# EAGLE design RGB_driver_main (EAGLE 6.4)
PROJECT: RGB_driver

## Sheet 1 of 7
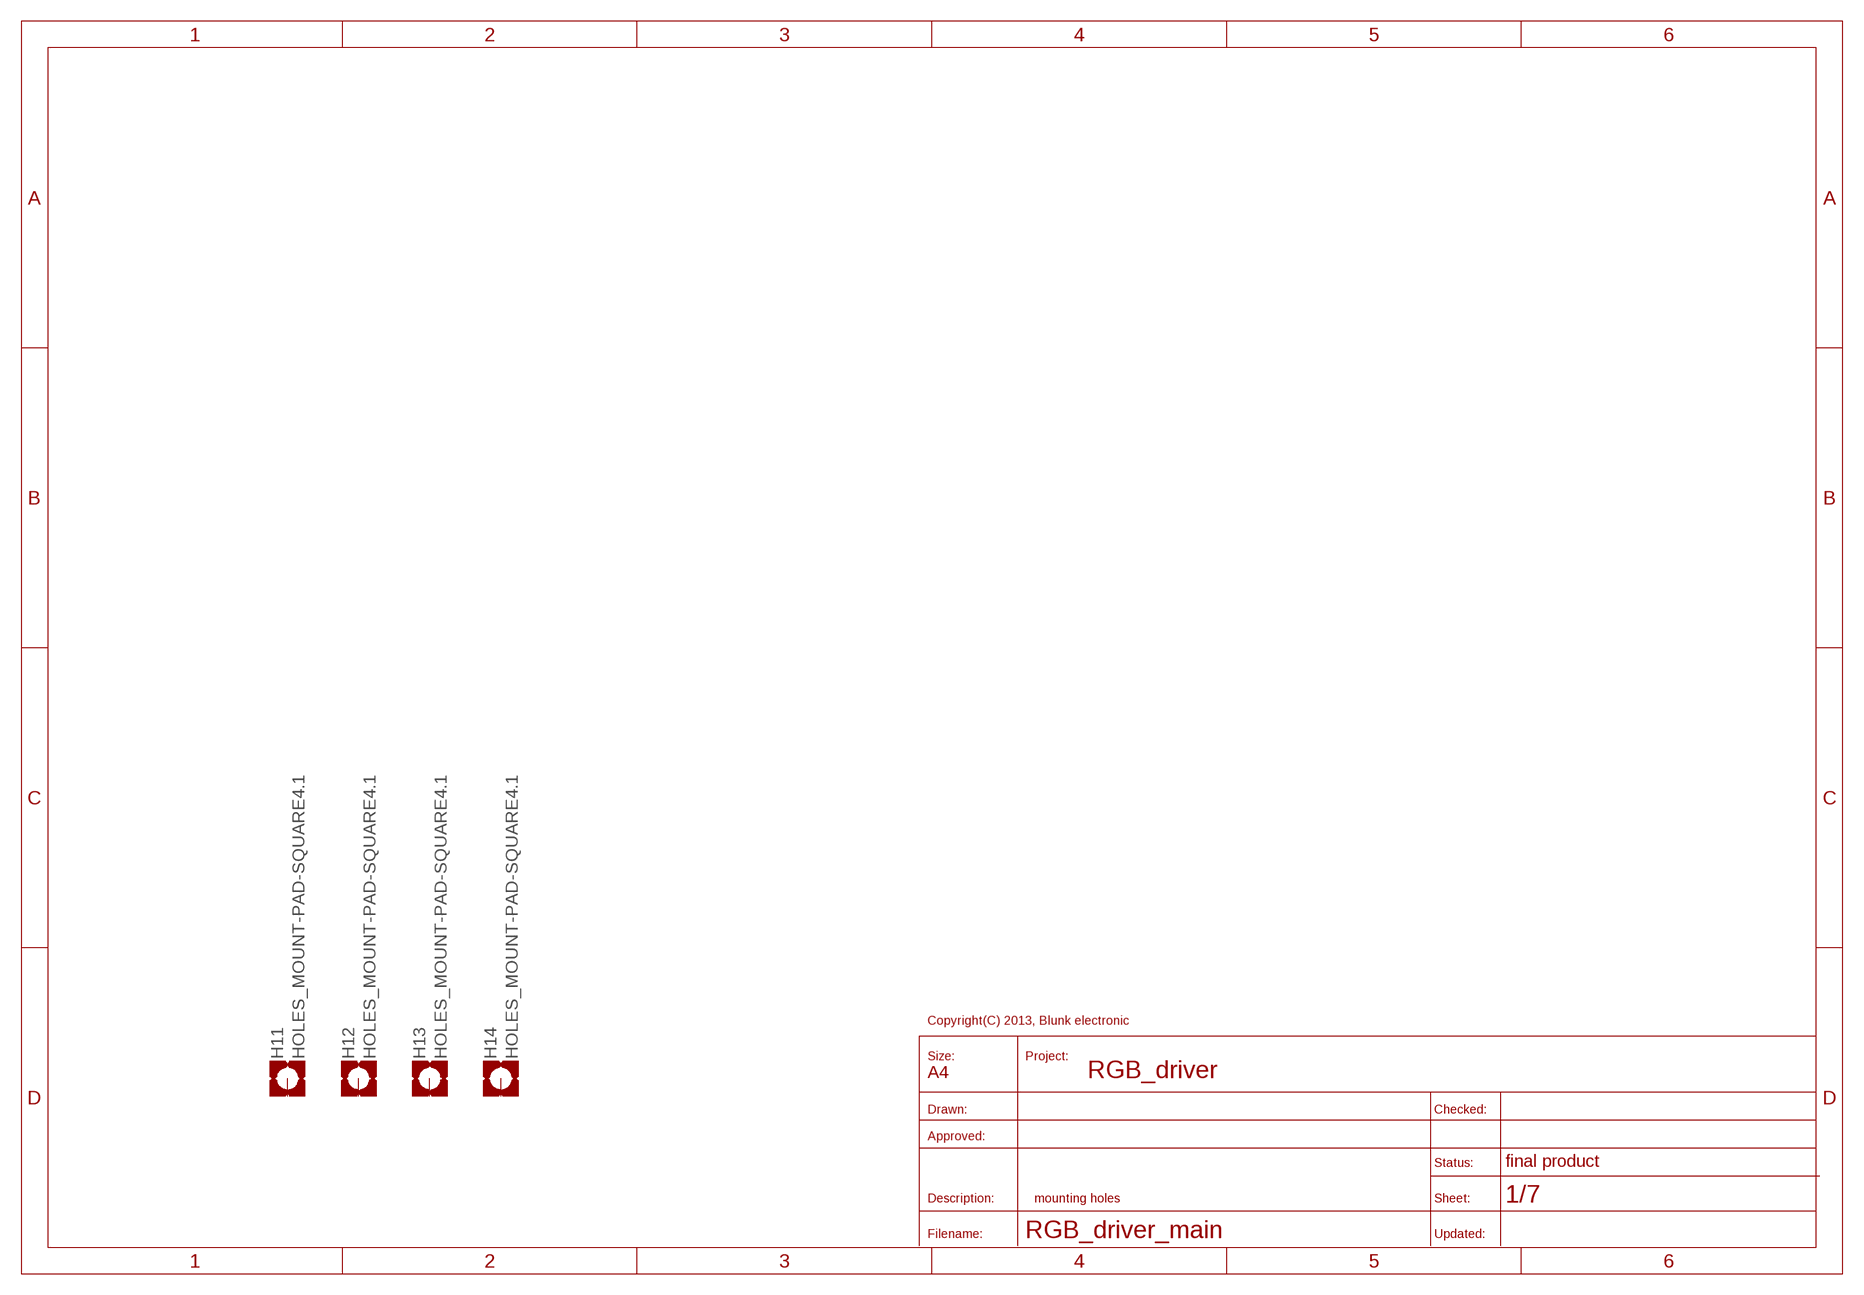
[diagram p0: schematic, sheet 1]
U$1 (A4_LANDSCAPE_FINAL): COMMISSIONED: 2013-03-26

### Parts
H11  HOLES_MOUNT-PAD-SQUARE4.1  [HOLES_4,1-PAD-SQUARE]
H12  HOLES_MOUNT-PAD-SQUARE4.1  [HOLES_4,1-PAD-SQUARE]
H13  HOLES_MOUNT-PAD-SQUARE4.1  [HOLES_4,1-PAD-SQUARE]
H14  HOLES_MOUNT-PAD-SQUARE4.1  [HOLES_4,1-PAD-SQUARE]
Unconnected: H11.B4,1(MOUNT) H12.B4,1(MOUNT) H13.B4,1(MOUNT) H14.B4,1(MOUNT)

### Notes on the sheet
- mounting holes

## Sheet 2 of 7
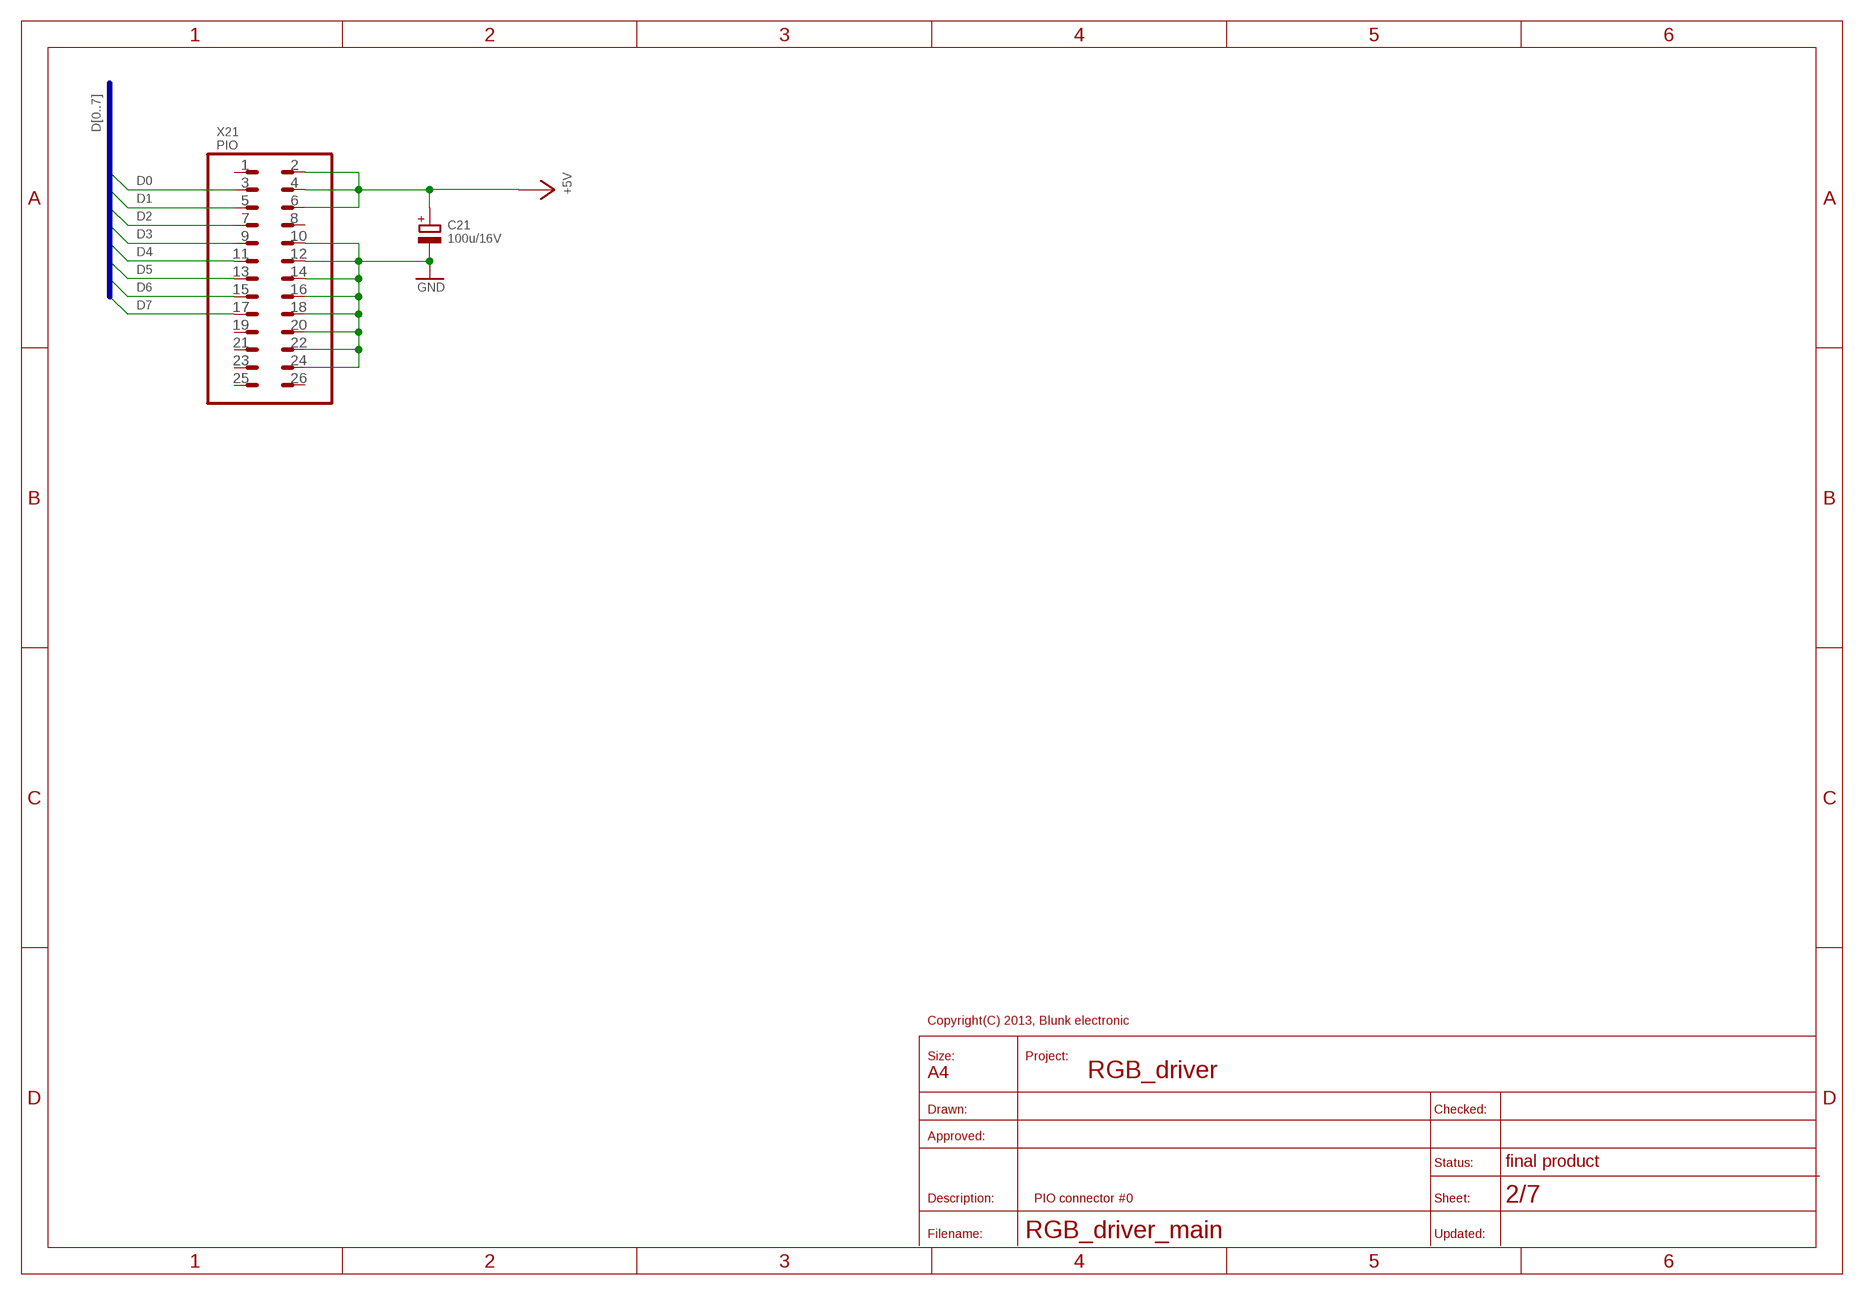
[diagram p1: schematic, sheet 2]
U$2 (A4_LANDSCAPE_FINAL): COMMISSIONED: 2013-03-26

### Parts
C21  100u/16V  C_POL_EU_T_D7/2.54  [T_D7/2.54]
X21  PIO  MALE_2X13-T-0  [T_PINHEAD_2X13-0]

### Nets
+5V [PWR]: C21.+ X21.2 X21.4 X21.6 ; also sheet 3,4,5,6,7
D0: X21.3 ; also sheet 3,4
D1: X21.5 ; also sheet 3,6
D2: X21.7 ; also sheet 3,5
D3: X21.9 ; also sheet 3,7
D4: X21.11 ; also sheet 3,7
D5: X21.13 ; also sheet 3,7
D6: X21.15 ; also sheet 3,7
D7: X21.17 ; also sheet 3
GND [PWR]: C21.- X21.10 X21.12 X21.14 X21.16 X21.18 X21.20 X21.22 X21.24 ; also sheet 3,4,5,6,7
Unconnected: X21.1 X21.8 X21.19 X21.21 X21.23 X21.25 X21.26

### Buses
D[0..7]

### Notes on the sheet
- PIO connector #0

## Sheet 3 of 7
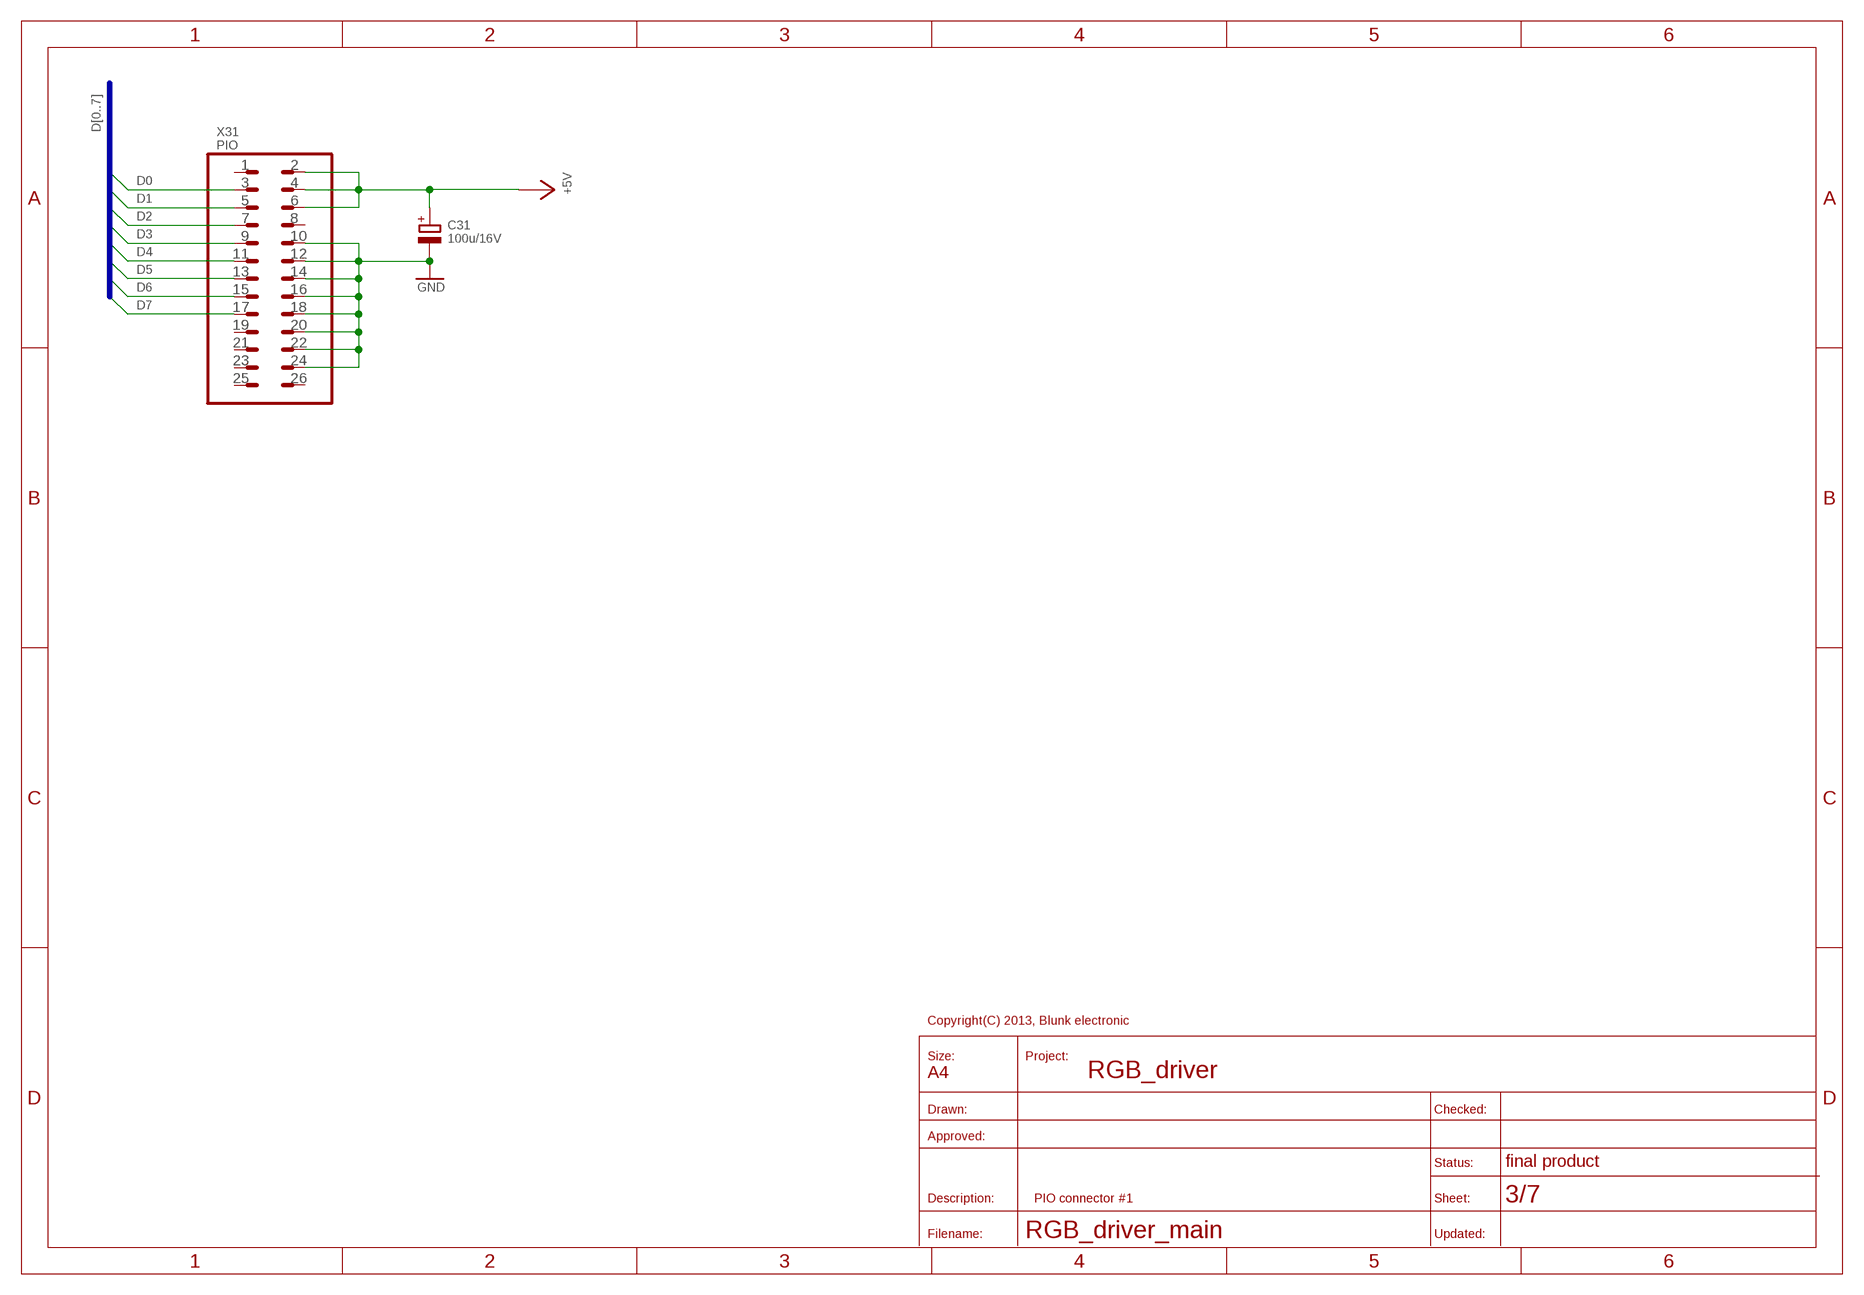
[diagram p2: schematic, sheet 3]
U$3 (A4_LANDSCAPE_FINAL): COMMISSIONED: 2013-03-26

### Parts
C31  100u/16V  C_POL_EU_T_D7/2.54  [T_D7/2.54]
X31  PIO  MALE_2X13-T-0  [T_PINHEAD_2X13-0]

### Nets
+5V [PWR]: C31.+ X31.2 X31.4 X31.6 ; also sheet 2,4,5,6,7
D0: X31.3 ; also sheet 2,4
D1: X31.5 ; also sheet 2,6
D2: X31.7 ; also sheet 2,5
D3: X31.9 ; also sheet 2,7
D4: X31.11 ; also sheet 2,7
D5: X31.13 ; also sheet 2,7
D6: X31.15 ; also sheet 2,7
D7: X31.17 ; also sheet 2
GND [PWR]: C31.- X31.10 X31.12 X31.14 X31.16 X31.18 X31.20 X31.22 X31.24 ; also sheet 2,4,5,6,7
Unconnected: X31.1 X31.8 X31.19 X31.21 X31.23 X31.25 X31.26

### Buses
D[0..7]

### Notes on the sheet
- PIO connector #1

## Sheet 4 of 7
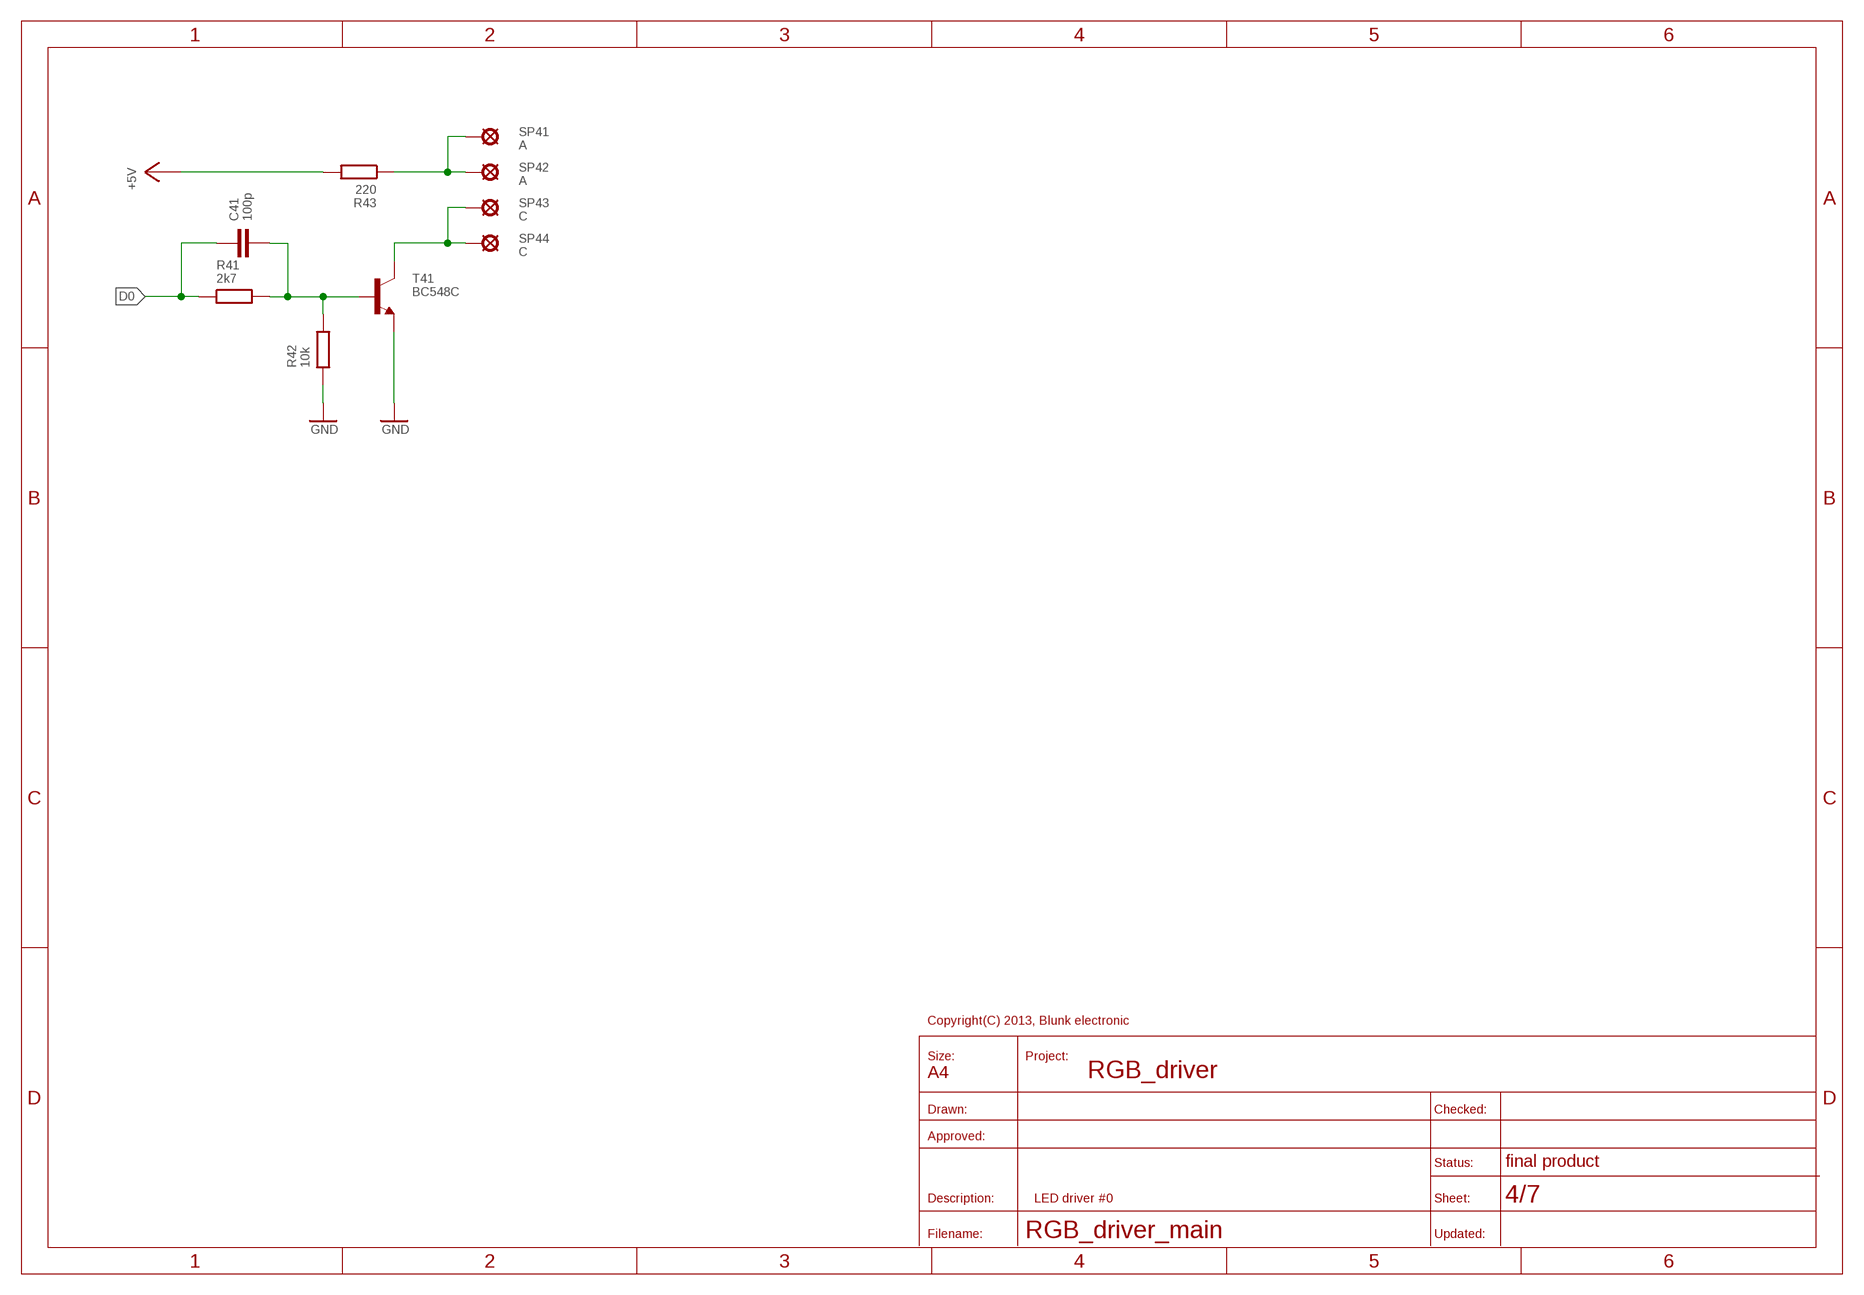
[diagram p3: schematic, sheet 4]
U$4 (A4_LANDSCAPE_FINAL): COMMISSIONED: 2013-03-26

### Parts
C41  100p  C_EU_S_0805  [S_0805]
R41  2k7  R_EU_S_0805  [S_0805]
R42  10k  R_EU_S_0805  [S_0805]
R43  220  R_EU_S_0805  [S_0805]
SP41  A  TEST_POINT-T-SMALL  [T_TEST_POINT_SMALL]
SP42  A  TEST_POINT-T-SMALL  [T_TEST_POINT_SMALL]
SP43  C  TEST_POINT-T-SMALL  [T_TEST_POINT_SMALL]
SP44  C  TEST_POINT-T-SMALL  [T_TEST_POINT_SMALL]
T41  BC548C  NPN  [T_TO-92-CBE]

### Nets
+5V [PWR]: R43.2 ; also sheet 2,3,5,6,7
A0: R43.1 SP41.1(MP) SP42.1(MP)
B0: C41.2 R41.2 R42.2 T41.B
C0: SP43.1(MP) SP44.1(MP) T41.C
D0: C41.1 R41.1 ; also sheet 2,3
GND [PWR]: R42.1 T41.E ; also sheet 2,3,5,6,7

### Notes on the sheet
- LED driver #0

## Sheet 5 of 7
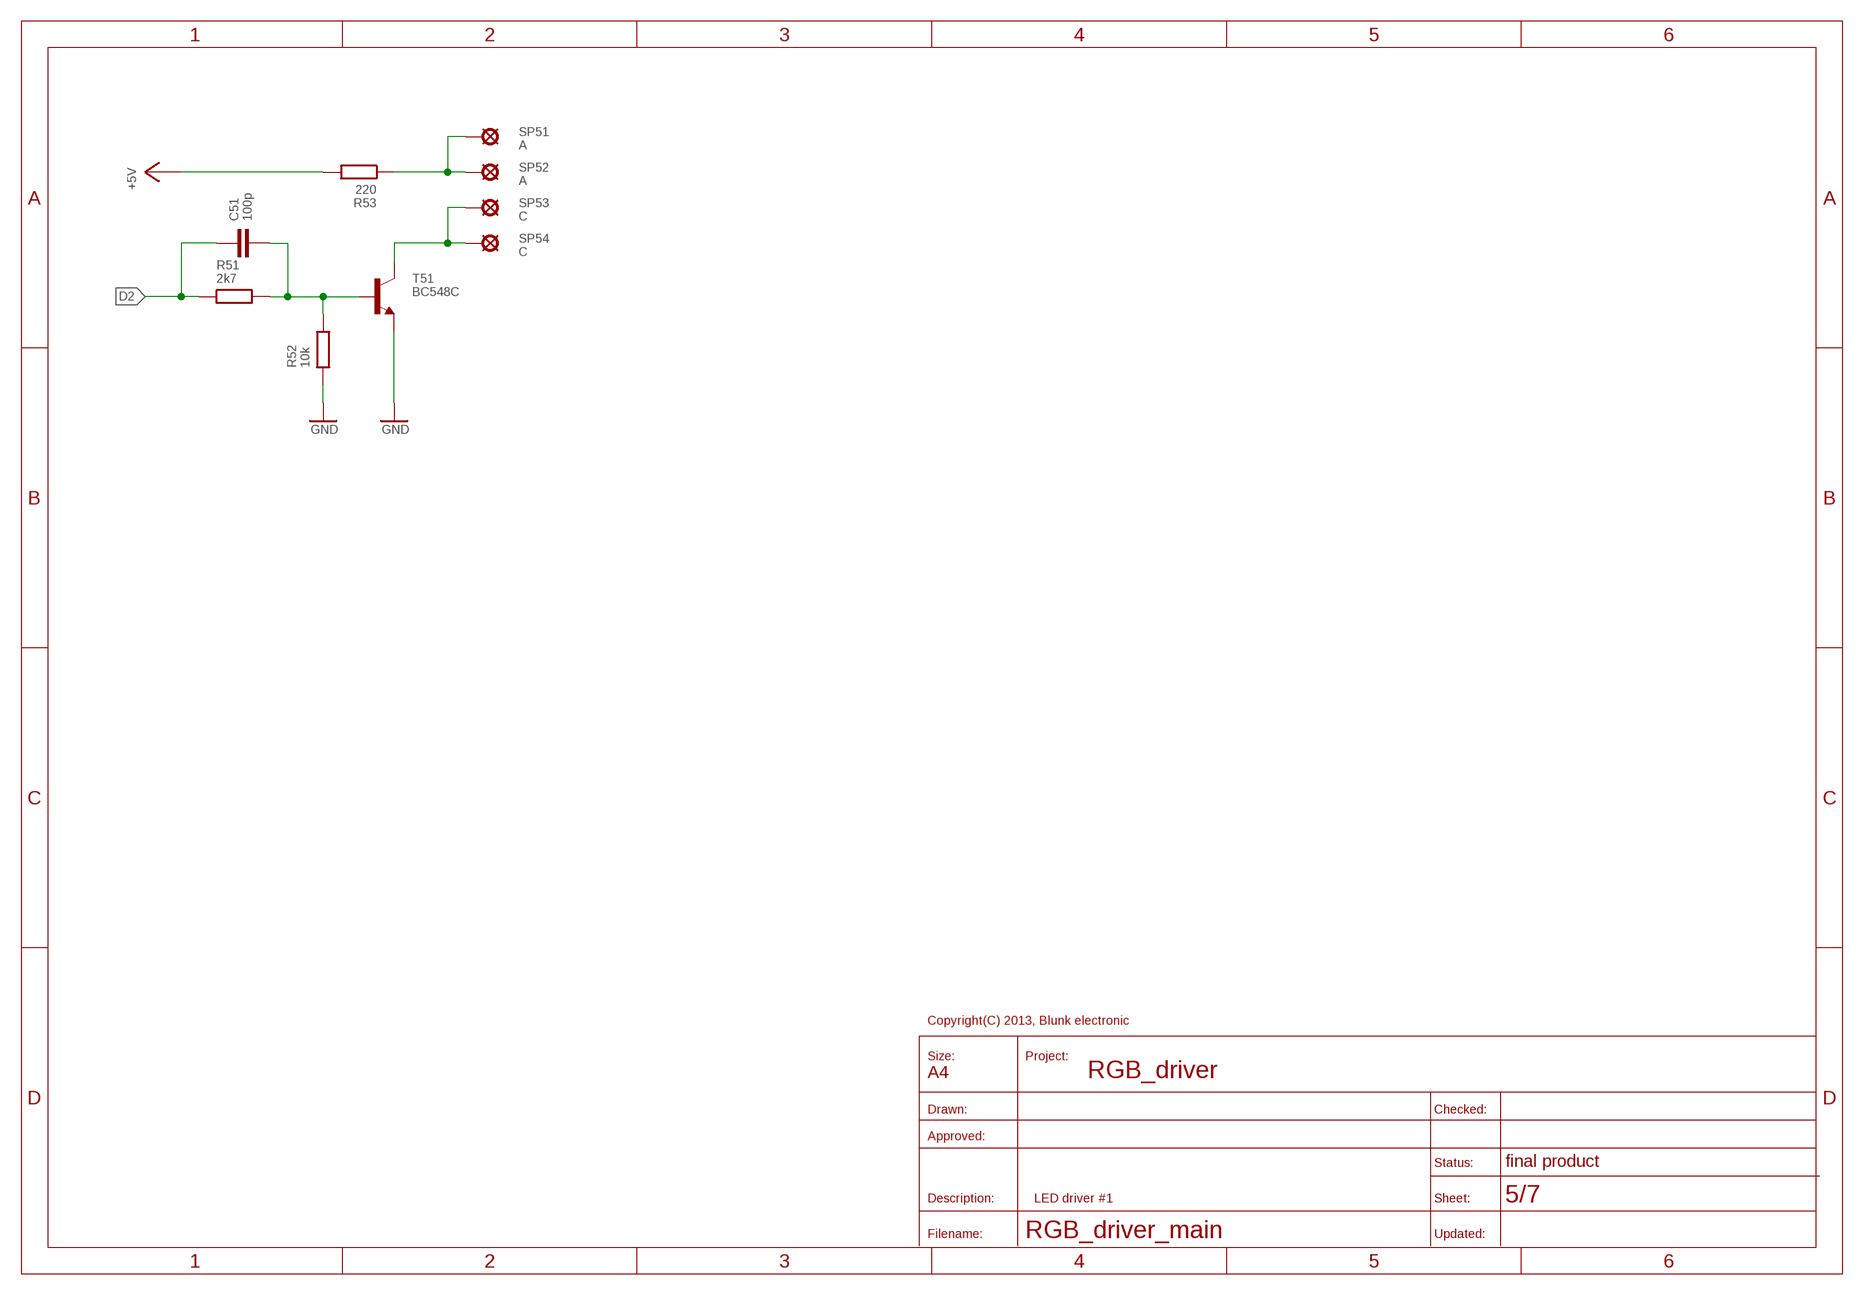
[diagram p4: schematic, sheet 5]
U$5 (A4_LANDSCAPE_FINAL): COMMISSIONED: 2013-03-26

### Parts
C51  100p  C_EU_S_0805  [S_0805]
R51  2k7  R_EU_S_0805  [S_0805]
R52  10k  R_EU_S_0805  [S_0805]
R53  220  R_EU_S_0805  [S_0805]
SP51  A  TEST_POINT-T-SMALL  [T_TEST_POINT_SMALL]
SP52  A  TEST_POINT-T-SMALL  [T_TEST_POINT_SMALL]
SP53  C  TEST_POINT-T-SMALL  [T_TEST_POINT_SMALL]
SP54  C  TEST_POINT-T-SMALL  [T_TEST_POINT_SMALL]
T51  BC548C  NPN  [T_TO-92-CBE]

### Nets
+5V [PWR]: R53.2 ; also sheet 2,3,4,6,7
A1: R53.1 SP51.1(MP) SP52.1(MP)
B1: C51.2 R51.2 R52.2 T51.B
C1: SP53.1(MP) SP54.1(MP) T51.C
D2: C51.1 R51.1 ; also sheet 2,3
GND [PWR]: R52.1 T51.E ; also sheet 2,3,4,6,7

### Notes on the sheet
- LED driver #1

## Sheet 6 of 7
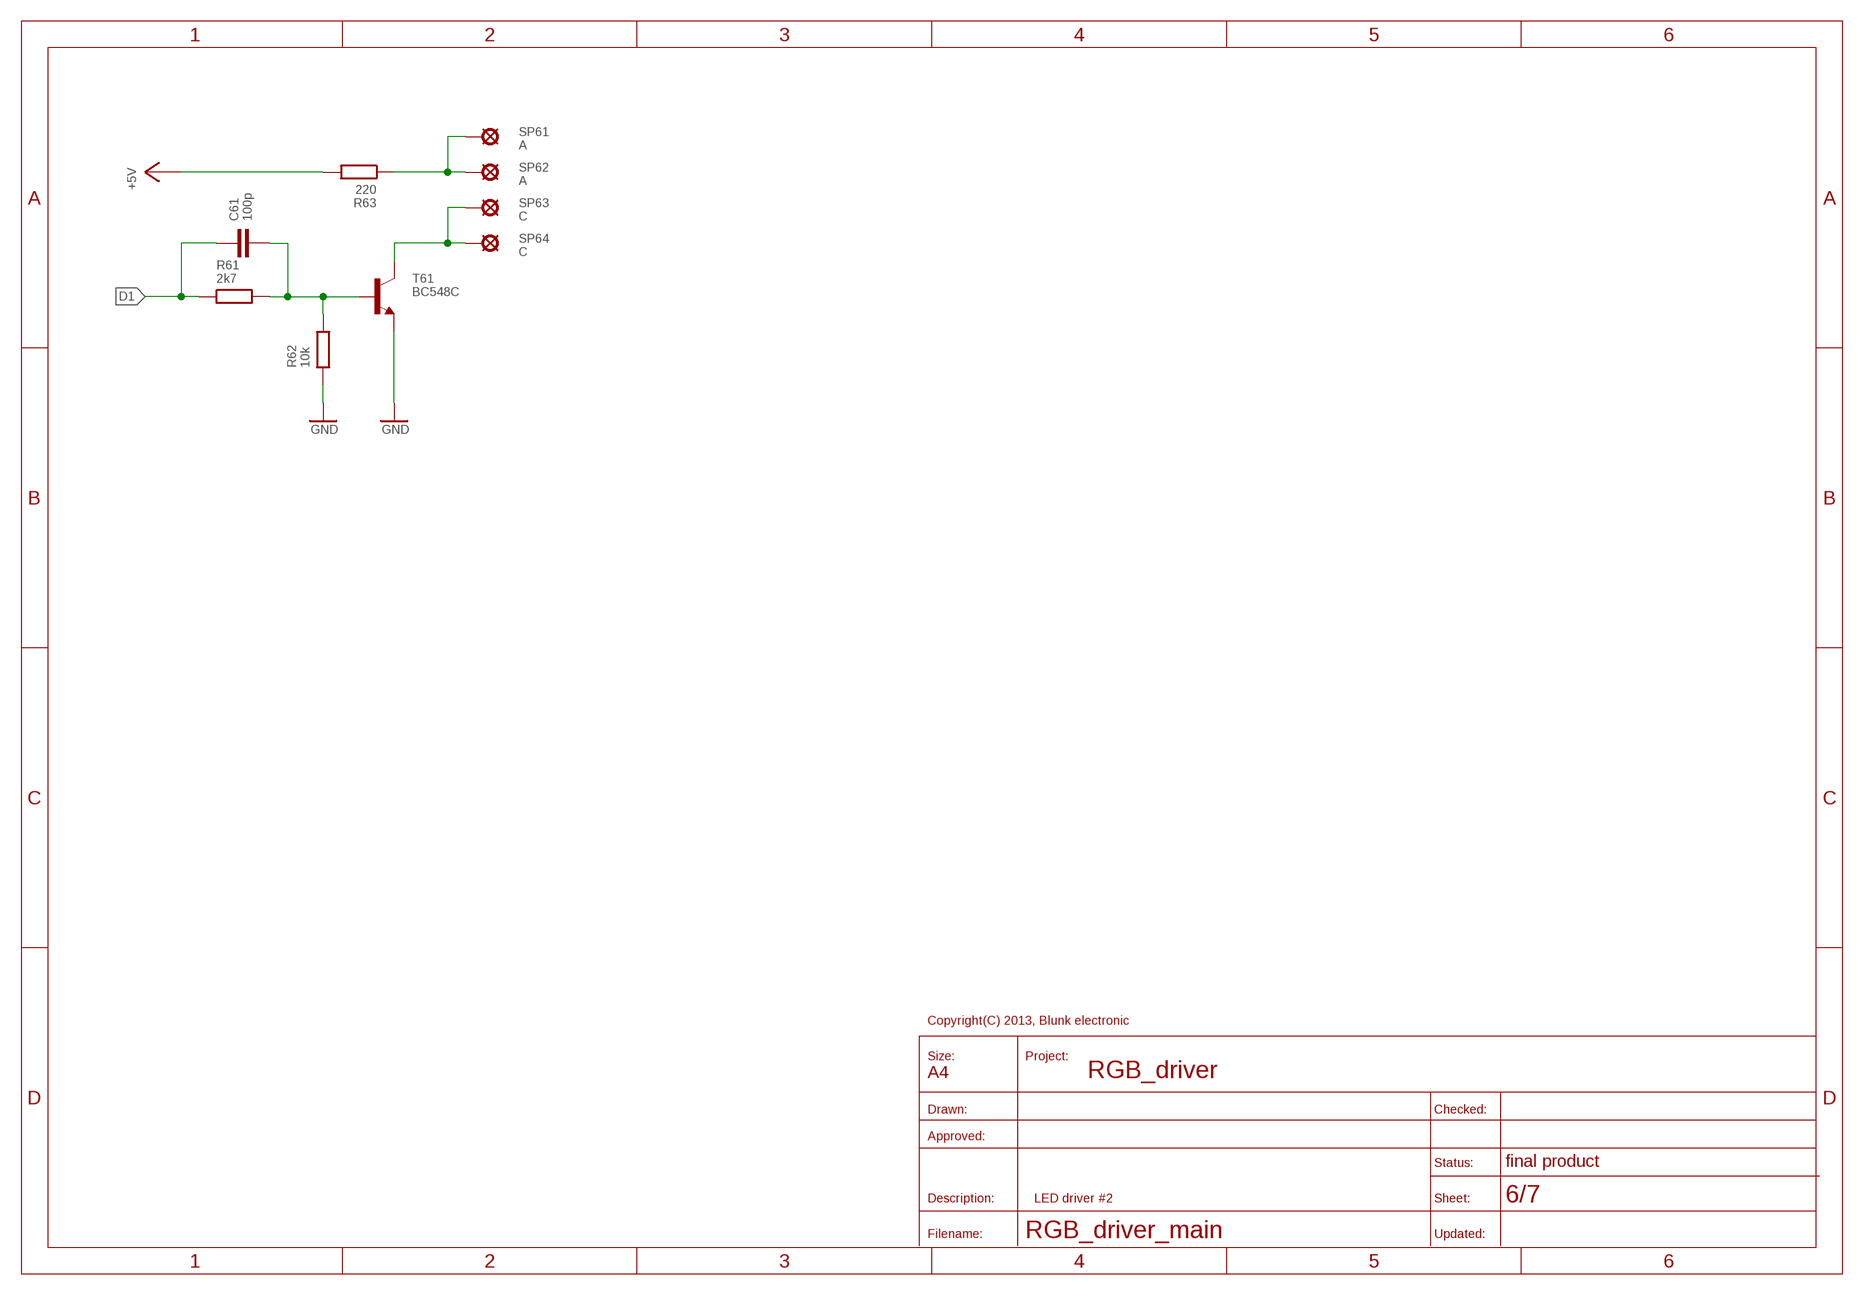
[diagram p5: schematic, sheet 6]
U$6 (A4_LANDSCAPE_FINAL): COMMISSIONED: 2013-03-26

### Parts
C61  100p  C_EU_S_0805  [S_0805]
R61  2k7  R_EU_S_0805  [S_0805]
R62  10k  R_EU_S_0805  [S_0805]
R63  220  R_EU_S_0805  [S_0805]
SP61  A  TEST_POINT-T-SMALL  [T_TEST_POINT_SMALL]
SP62  A  TEST_POINT-T-SMALL  [T_TEST_POINT_SMALL]
SP63  C  TEST_POINT-T-SMALL  [T_TEST_POINT_SMALL]
SP64  C  TEST_POINT-T-SMALL  [T_TEST_POINT_SMALL]
T61  BC548C  NPN  [T_TO-92-CBE]

### Nets
+5V [PWR]: R63.2 ; also sheet 2,3,4,5,7
A2: R63.1 SP61.1(MP) SP62.1(MP)
B2: C61.2 R61.2 R62.2 T61.B
C2: SP63.1(MP) SP64.1(MP) T61.C
D1: C61.1 R61.1 ; also sheet 2,3
GND [PWR]: R62.1 T61.E ; also sheet 2,3,4,5,7

### Notes on the sheet
- LED driver #2

## Sheet 7 of 7
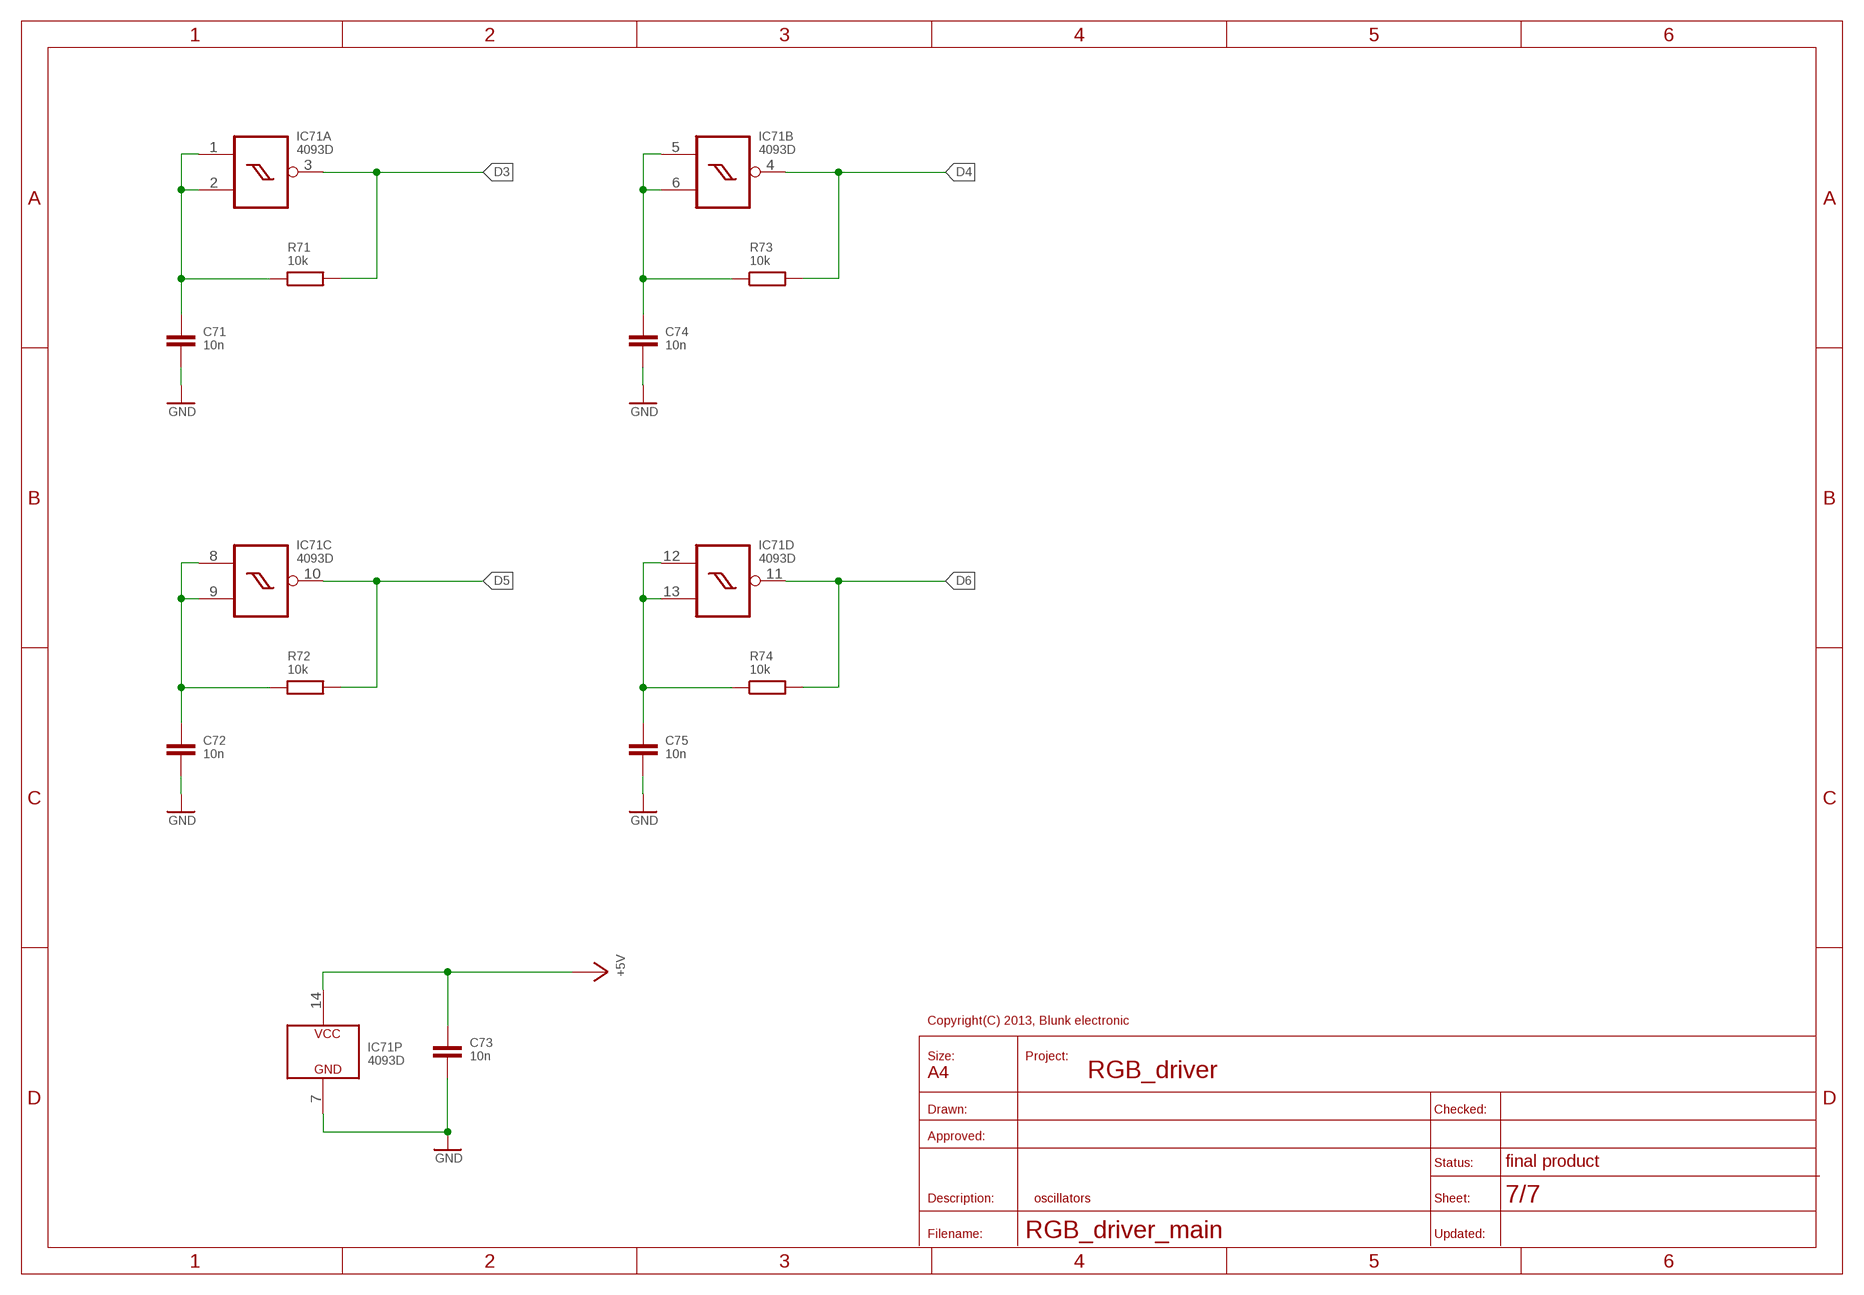
[diagram p6: schematic, sheet 7]
U$7 (A4_LANDSCAPE_FINAL): COMMISSIONED: 2013-03-26

### Parts
C71  10n  C_EU_S_0805  [S_0805]
C72  10n  C_EU_S_0805  [S_0805]
C73  10n  C_EU_S_0805  [S_0805]
C74  10n  C_EU_S_0805  [S_0805]
C75  10n  C_EU_S_0805  [S_0805]
IC71  4093D  [S_SO14]
R71  10k  R_EU_S_0805  [S_0805]
R72  10k  R_EU_S_0805  [S_0805]
R73  10k  R_EU_S_0805  [S_0805]
R74  10k  R_EU_S_0805  [S_0805]

### Nets
+5V [PWR]: C73.1 IC71.14(P:VCC) ; also sheet 2,3,4,5,6
D3: IC71.3(A:O) R71.2 ; also sheet 2,3
D4: IC71.4(B:O) R73.2 ; also sheet 2,3
D5: IC71.10(C:O) R72.2 ; also sheet 2,3
D6: IC71.11(D:O) R74.2 ; also sheet 2,3
GND [PWR]: C71.2 C72.2 C73.2 C74.2 C75.2 IC71.7(P:GND) ; also sheet 2,3,4,5,6
OSC_RC0: C71.1 IC71.1(A:I0) IC71.2(A:I1) R71.1
OSC_RC1: C74.1 IC71.5(B:I0) IC71.6(B:I1) R73.1
OSC_RC2: C72.1 IC71.8(C:I0) IC71.9(C:I1) R72.1
OSC_RC3: C75.1 IC71.12(D:I0) IC71.13(D:I1) R74.1

### Notes on the sheet
- oscillators

## Library data of the parts
C21 C31 = be_rcl:C_POL_EU: Polarized Capacitor Device EU drawn: Mario Blunk / Blunk electronic; COMMISSIONED: 2013-05-06
C41 C51 C61 C71-C75 = be_rcl:C_EU: Capacitor Device EU drawn: Mario Blunk / Blunk electronic
H11-H14 = be_mount_holes:HOLES_MOUNT-PAD-SQUARE: MOUNTING PAD, square
IC71 = be_logic:4093: Quad 2-input NAND with schmitt trigger inputs drawn: Mario Blunk / Blunk electronic; COMMISSIONED: 2013-05-06
R41-R43 R51-R53 R61-R63 R71-R74 = be_rcl:R_EU: Resistor Device EU drawn: Mario Blunk / Blunk electronic
SP41-SP44 SP51-SP54 SP61-SP64 = be_con_jump:TEST_POINT: test point device drawn: Mario Blunk / Blunk electronic; COMMISSIONED: 2013-03-28
T41 T51 T61 = be_transistoren:NPN: NPN Transistor device drawn: Mario Blunk / Blunk electronic; COMMISSIONED: 2013-05-03
X21 X31 = be_con_jump:MALE_2X13: male connector device 2x13 drawn: Mario Blunk / Blunk electronic; COMMISSIONED: 2013-05-06

## Net classes
1 PWR: width 0.254 mm

## Board
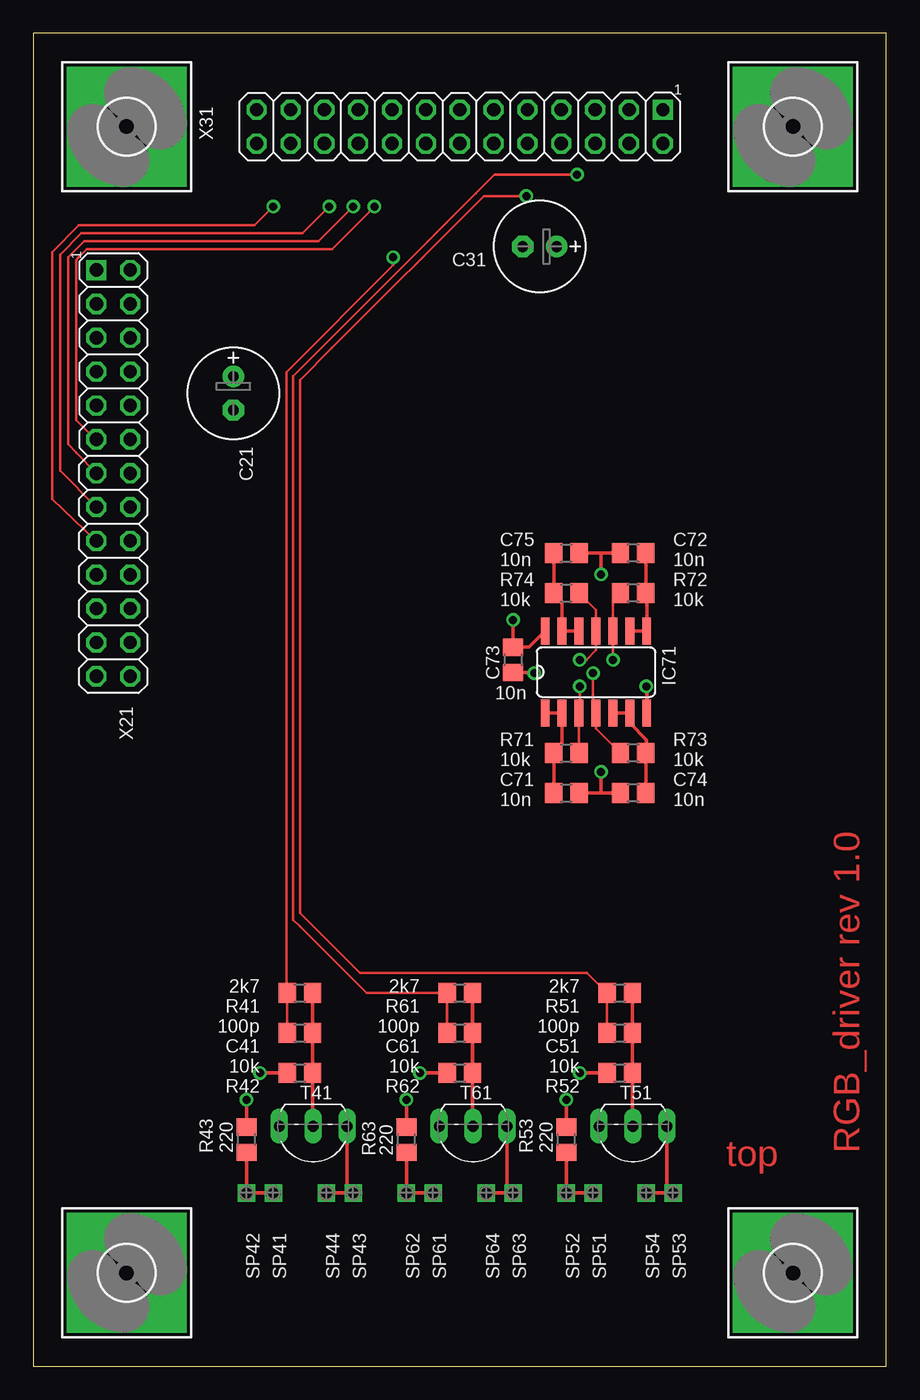
[diagram p7: board, top side]
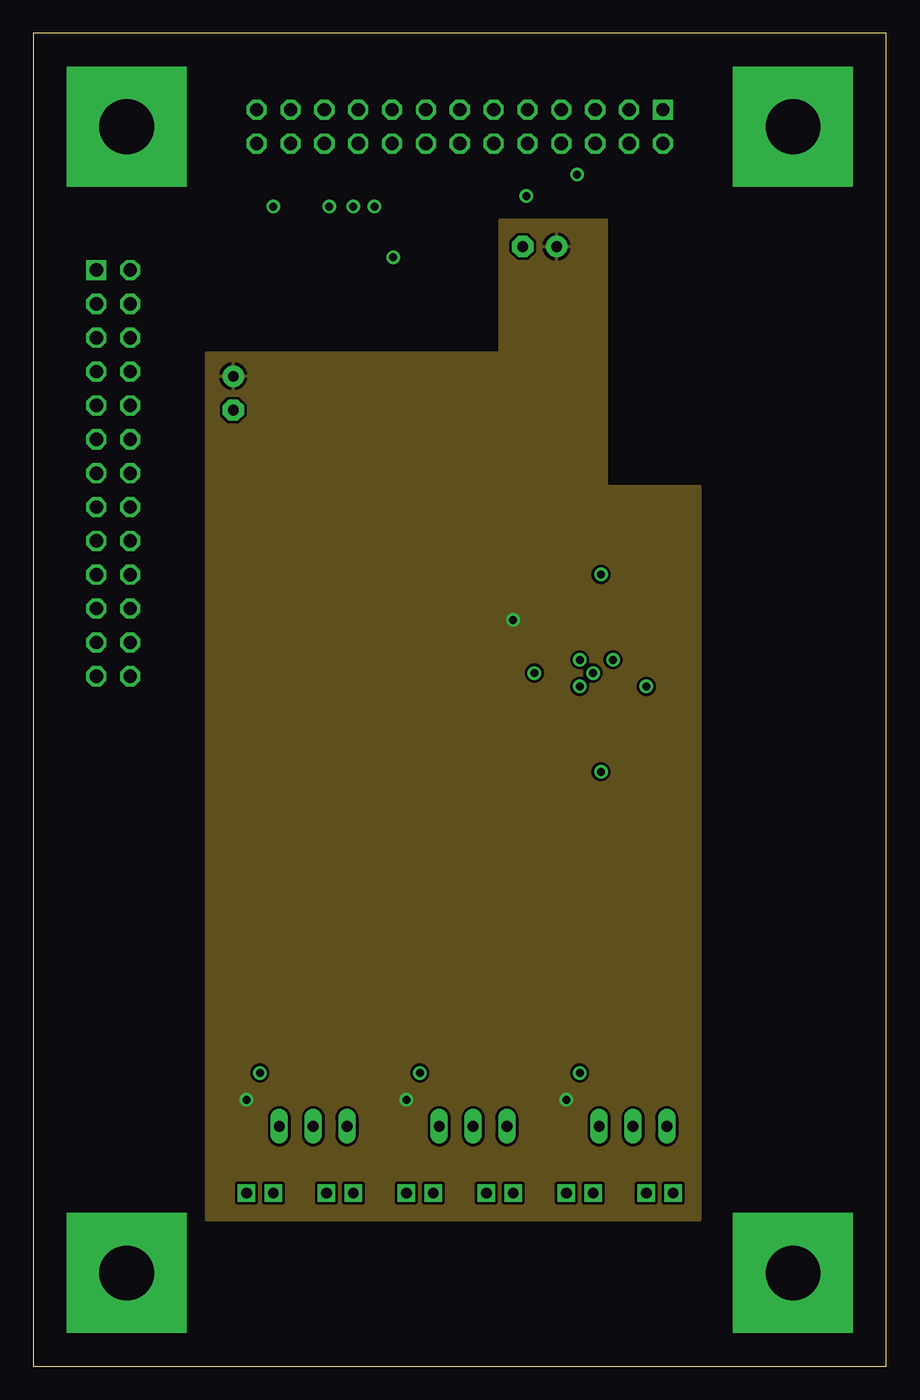
[diagram p8: board, inner layer Route2]
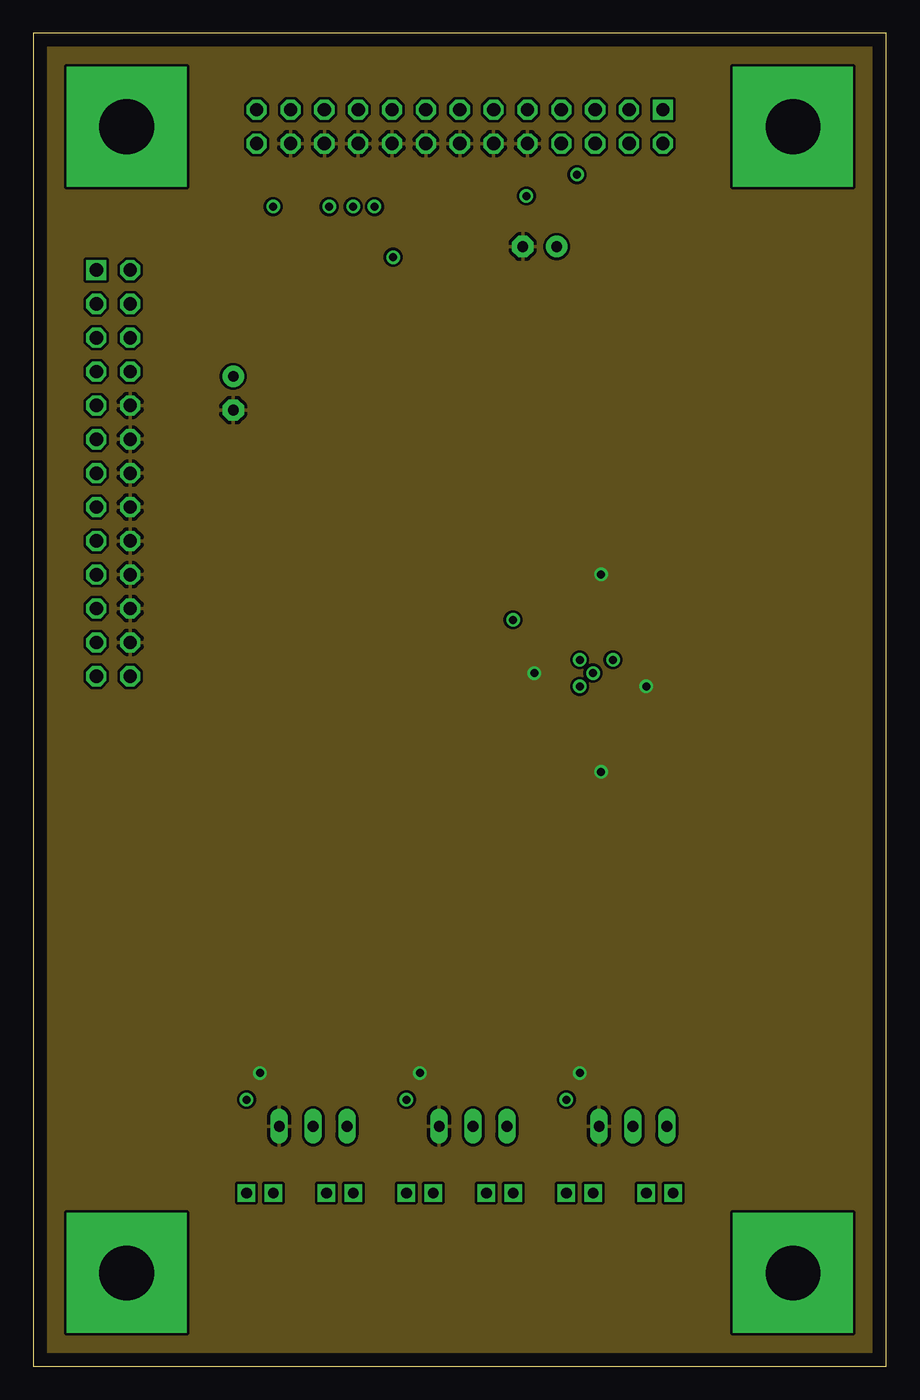
[diagram p9: board, inner layer Route15]
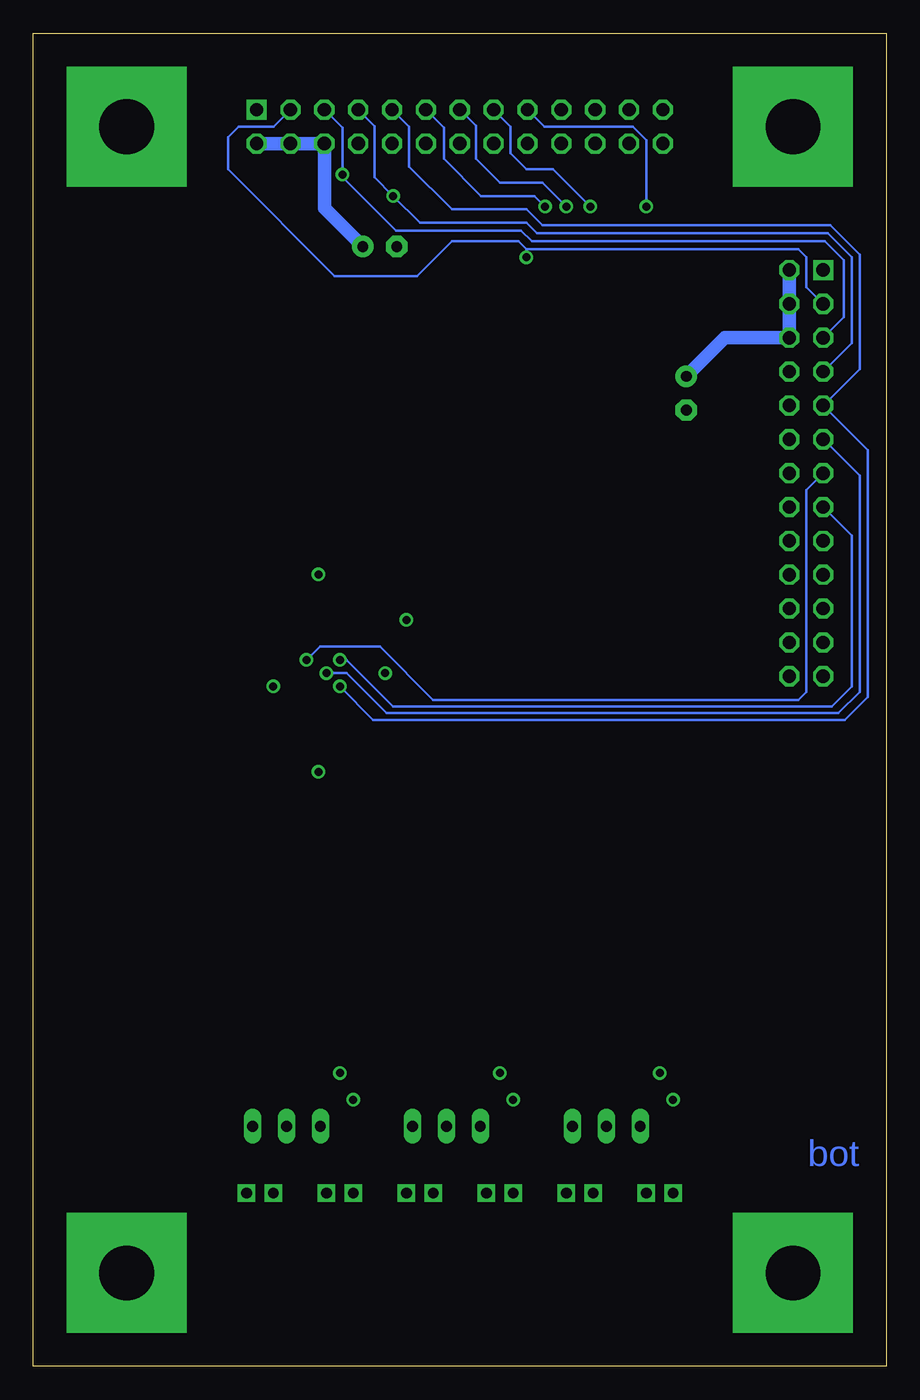
[diagram p10: board, bottom side, seen from below]

Size 64 x 100 mm. Coordinates in mm from the lower left corner, seen from the top.
Outline: 0,0 64,0 64,100 0,100 0,0
Copper layers (1+2*15+16): Top 0.035mm / dielectric 0.2mm / Route2 0.035mm / dielectric 0.8mm / Route15 0.035mm / dielectric 0.2mm / Bottom 0.035mm
Design rules "default *": minimum track width 8mil, minimum drill 0.6mm, track to track 8mil, track to pad 8mil, pad to pad 8mil, via to via 8mil, smd to smd 8mil, copper to edge 40mil, drill to drill 8mil, minimum pad ring 10mil, minimum via ring 8mil, stop-mask expansion 4mil, vias tented up to drill 0.6mm, thermal gap 10mil

### Footprints (pad centres in the part's own frame; a part is rotated, then mirrored left to right if it is on the bottom)
T_D7/2.54 = drill 0.8 pad 1.6: + -1.27,0 | drill 0.8 pad 1.6 octagon: - 1.27,0
S_0805 = smd 1.3 x 1.5: 1 -0.95,0; 2 0.95,0
HOLES_4,1-PAD-SQUARE = drill 4.1 pad 9 square: B4,1 0,0
S_SO14 = smd 0.66 x 2.032: 1 -3.81,-3.073; 2 -2.54,-3.073; 3 -1.27,-3.073; 4 0,-3.073; 5 1.27,-3.073; 6 2.54,-3.073; 7 3.81,-3.073; 8 3.81,3.073; 9 2.54,3.073; 10 1.27,3.073; 11 0,3.073; 12 -1.27,3.073; 13 -2.54,3.073; 14 -3.81,3.073
T_TEST_POINT_SMALL = drill 0.8 square: 1 0,0
T_TO-92-CBE = drill 0.813 long: B 0,0; C -2.54,0; E 2.54,0
T_PINHEAD_2X13-0 = drill 1 square: 1 -15.24,-1.27 | drill 1 octagon: 2 -15.24,1.27; 3 -12.7,-1.27; 4 -12.7,1.27; 5 -10.16,-1.27; 6 -10.16,1.27; 7 -7.62,-1.27; 8 -7.62,1.27; 9 -5.08,-1.27; 10 -5.08,1.27; 11 -2.54,-1.27; 12 -2.54,1.27; 13 0,-1.27; 14 0,1.27; 15 2.54,-1.27; 16 2.54,1.27; 17 5.08,-1.27; 18 5.08,1.27; 19 7.62,-1.27; 20 7.62,1.27; 21 10.16,-1.27; 22 10.16,1.27; 23 12.7,-1.27; 24 12.7,1.27; 25 15.24,-1.27; 26 15.24,1.27

### Placement (x,y rotation side)
C21  15,73 270 top
C31  38,84 180 top
C41  20,25 0 top
C51  44,25 0 top
C61  32,25 0 top
C71  40,43 0 top
C72  45,61 180 top
C73  36,53 270 top
C74  45,43 180 top
C75  40,61 0 top
H11  57,7 0 top
H12  7,93 0 top
H13  57,93 0 top
H14  7,7 0 top
IC71  42.22,52.08 0 top
R41  20,28 0 top
R42  20,22 0 top
R43  16,17 90 top
R51  44,28 0 top
R52  44,22 0 top
R53  40,17 90 top
R61  32,28 0 top
R62  32,22 0 top
R63  28,17 90 top
R71  40,46 0 top
R72  45,58 180 top
R73  45,46 180 top
R74  40,58 0 top
SP41  18,13 180 top
SP42  16,13 180 top
SP43  24,13 180 top
SP44  22,13 180 top
SP51  42,13 180 top
SP52  40,13 180 top
SP53  48,13 180 top
SP54  46,13 180 top
SP61  30,13 180 top
SP62  28,13 180 top
SP63  36,13 180 top
SP64  34,13 180 top
T41  21,18 180 top
T51  45,18 180 top
T61  33,18 180 top
X21  6,67 270 top
X31  32,93 180 top

### Tracks (layer width: path | path; a pad name or v marks a point on that pad's centre or on a via)
+5V  (via drill 0.6)
  Top 0.254: IC71.14 37.21,53.95 C73.1 v36,56 | R43.2 v16,20 | R63.2 v28,20 | R53.2 v40,20
  Bottom 1: X21.2 X21.4 X21.6 12.11,77.16 C21.+ | X31.2 X31.4 X31.6 42.16,86.89 C31.+
  pour Route2: 13,76 35,76 35,86 43,86 43,66 50,66 50,11 13,11
A0
  Top 0.254: R43.1 SP42.1 SP41.1
A1
  Top 0.254: R53.1 SP52.1 SP51.1
A2
  Top 0.254: R63.1 SP62.1 SP61.1
B0
  Top 0.254: T41.B 20.95,18 R42.2 C41.2 R41.2
B1
  Top 0.254: T51.B 44.95,18 R52.2 C51.2 R51.2
B2
  Top 0.254: T61.B 32.95,18 R62.2 C61.2 R61.2
C0
  Top 0.254: SP44.1 SP43.1 23.54,13 T41.C
C1
  Top 0.254: SP54.1 SP53.1 47.54,13 T51.C
C2
  Top 0.254: SP64.1 SP63.1 35.54,13 T61.C
D0  (via drill 0.6)
  Top 0.203: C41.1 R41.1 19,28 19,73 19,74.6 27,82.6 v27,83.2
  Bottom 0.203: X31.3 45.97,93 48.6,93 49.4,92.2 49.4,89.8 41.4,81.8 35.2,81.8 32.6,84.4 30.8,84.4 28,84.4 27.6,84.4 27,83.8 | X21.3 6,80.97 6,83.2 6.6,83.8 10.8,83.8 27,83.8 | 27,83.8 v27,83.2
D1  (via drill 0.6)
  Top 0.203: C61.1 R61.1 25,28 20,33 19.5,33.5 19.5,73 19.5,74.3 33.2,88 34.6,89.4 39.8,89.4 v40.8,89.4
  Bottom 0.203: X31.5 40.8,92.91 v40.8,89.4 40.8,89.2 36.8,85.2 27.4,85.2 26.6,84.4 6,84.4 4.6,84.4 3.2,83 3.2,78.69 X21.5
D2  (via drill 0.6)
  Top 0.203: C51.1 R51.1 41.55,29.5 24.5,29.5 20,34 20,43 20,73 20,74 22.4,76.4 33.8,87.8 v37,87.8
  Bottom 0.203: X31.7 38.4,93.05 38.4,89.2 v37,87.8 35,85.8 27,85.8 26.2,85 24.8,85 4.4,85 2.6,83.2 2.6,76.75 X21.7
D3  (via drill 0.6)
  Top 0.203: R71.2 IC71.3 41,49.06 v41,51
  Bottom 0.203: v41,51 38.5,48.5 12,48.5 3.1,48.5 1.4,50.2 1.4,61.2 1.4,68.75 X21.9 2,74.81 2,83.4 4.2,85.6 25.8,85.6 27,86.8 32.6,86.8 35.8,90 35.8,92.99 X31.9
D4  (via drill 0.6)
  Top 0.203: R73.2 42.22,47.83 IC71.4 42,49.23 v42,52 | v25.6,87 22.4,83.8 4,83.8 3.4,83.2 3.2,83 3.2,80.4 3.2,75.8 3.2,71 4.66,69.54 X21.11
  Bottom 0.203: v42,52 40.5,52 37.5,49 12,49 3.6,49 2,50.6 2,57.8 2,66.81 X21.11 | X31.11 33.2,92.93 33.2,90.6 30.4,87.8 26.4,87.8 v25.6,87
D5  (via drill 0.6)
  Top 0.203: R72.2 43.49,57.44 IC71.10 v43.49,53.01 v43.5,53 | v24,87 21.4,84.4 11.6,84.4 3.8,84.4 2.6,83.2 2.6,76.4 2.6,69.2 3.2,68.53 X21.13
  Bottom 0.203: v43.5,53 42.5,54 40,54 38,54 34,50 12,50 6.6,50 6,50.6 6,65.73 X21.13 | X31.13 30.8,93.07 30.8,90.6 29,88.8 27.2,88.8 25.8,88.8 v24,87
D6  (via drill 0.6)
  Top 0.203: R74.2 42.22,56.73 IC71.11 42.22,53.72 41.5,53 v41,53 | v22.2,87 20.2,85 3.6,85 2,83.4 2,76.4 2,67.19 X21.15
  Bottom 0.203: v41,53 40.5,53 37,49.5 12,49.5 4.1,49.5 2.6,51 2.6,58 2.6,62.33 X21.15 | X31.15 28.2,93.01 28.2,91 27,89.8 25.4,89.8 25,89.8 v22.2,87
D7  (via drill 0.6)
  Top 0.203: v18,87 16.6,85.6 14.2,85.6 3.4,85.6 1.4,83.6 1.4,68.6 1.4,65.05 X21.17
  Bottom 0.203: X31.17 25.65,93 22,93 19,93 18,92 18,90.5 v18,87
GND  (via drill 0.6)
  Top 0.254: R42.1 v17,22 | R52.1 v41,22 | R62.1 v29,22 | C75.2 C72.2 42.6,61 v42.6,59.4 | C71.2 C74.2 42.6,43 v42.6,44.6 | IC71.7 46.03,50.97 v46,51 | C73.2 37.6,52.05 v37.6,52
  pour Route15: 0,0 64,0 64,100 0,100
OSC_RC0
  Top 0.254: IC71.1 IC71.2 39.68,46.63 R71.1 C71.1
OSC_RC1
  Top 0.254: IC71.5 IC71.6 44.76,48.24 46,47 46,46.05 R73.1 C74.1
OSC_RC2
  Top 0.254: IC71.9 IC71.8 46.03,57.92 R72.1 C72.1
OSC_RC3
  Top 0.254: IC71.12 IC71.13 39.68,57.37 R74.1 C75.1

### Text on the board
Top: RGB_driver rev 1.0 | top
Bottom: bot